# Altium schematic sheet Э3_6.SchDoc
size 420 x 297 mm; SheetNumber: 6; Scale: 1:1; DocumentType: Схема электрическая принципиальная
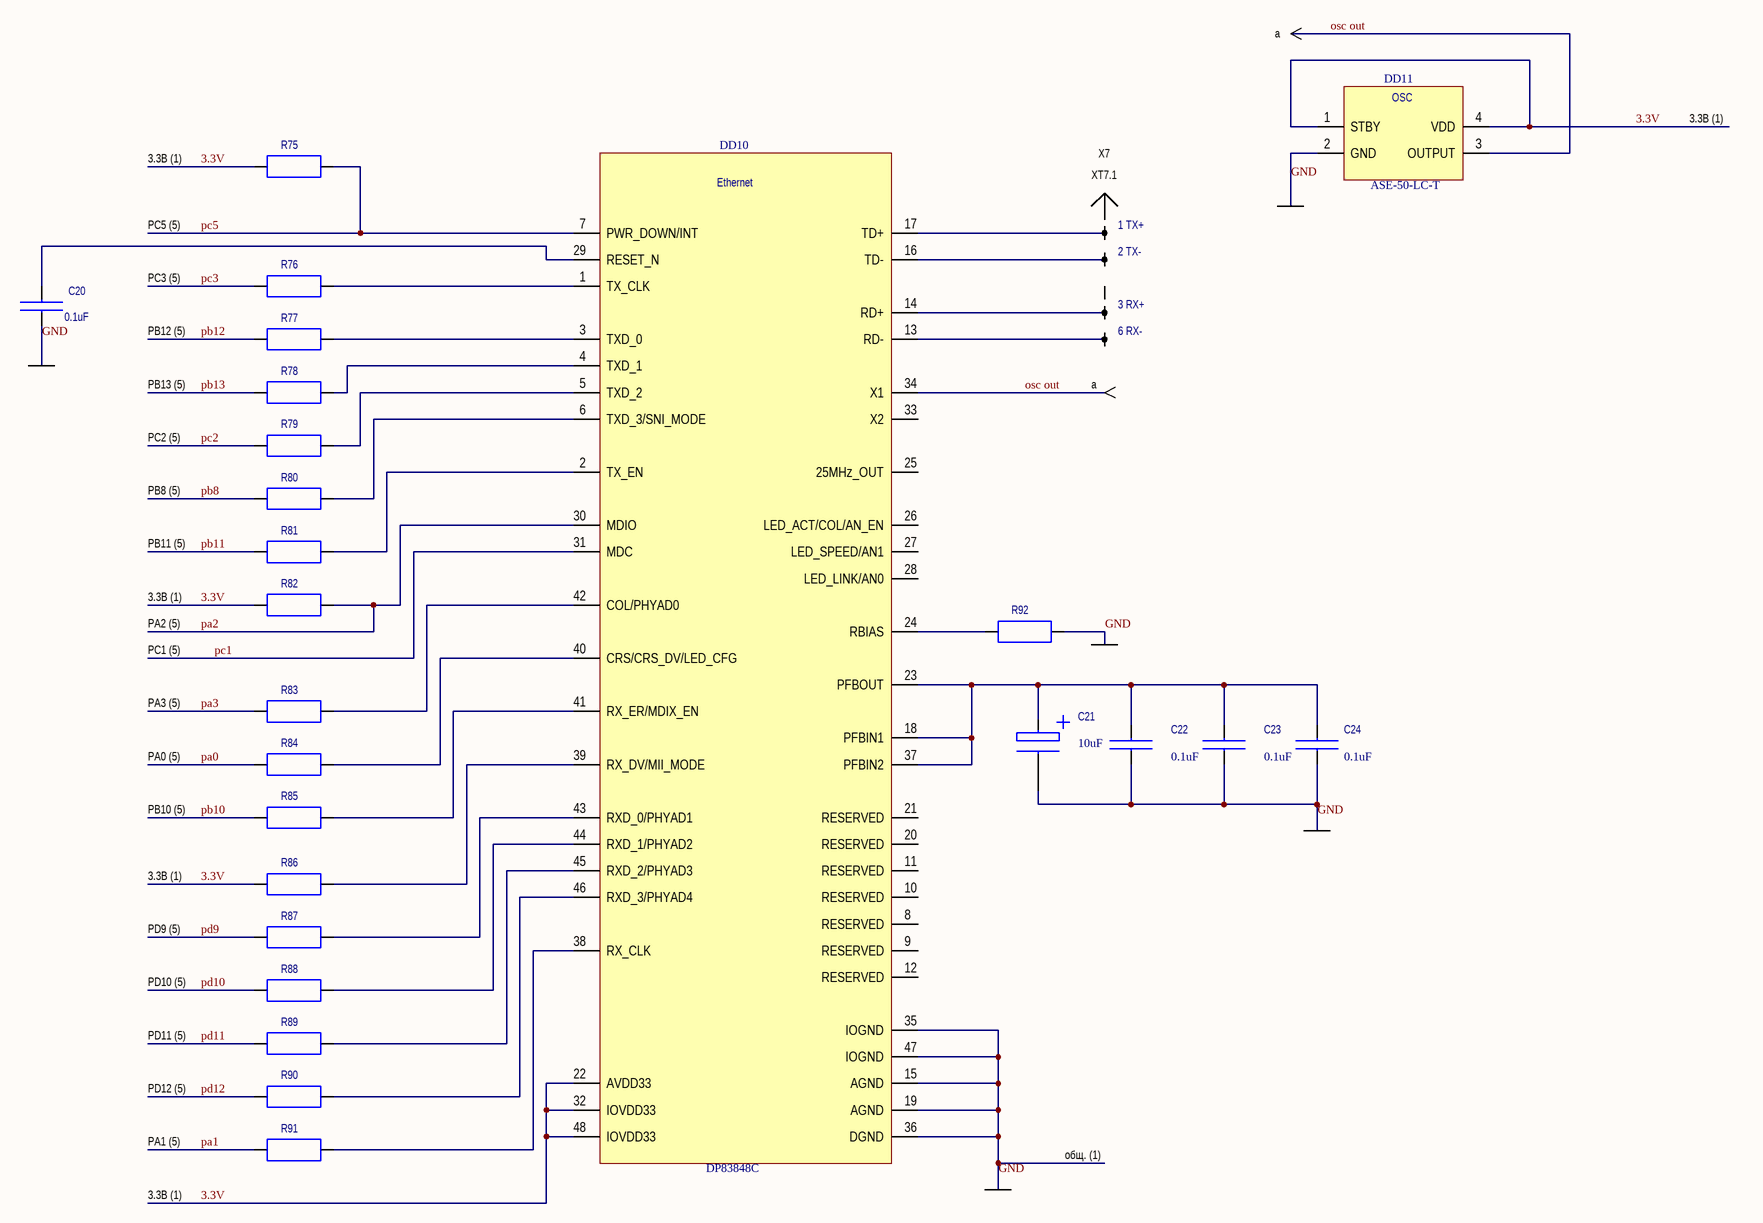
[diagram p0: Э3_6.SchDoc]

## Parts
C20  0.1uF  [CAP0805]
C21  10uF  [CAPT]
C22  0.1uF  [CAP0805]
C23  0.1uF
C24  0.1uF
DD10  DP83848C  [VBH48A_N]
DD11  ASE-50-LC-T  [ASE_OSC]
R75  2.2k  [RES0805]  (value not drawn)
R76  51  [RES0805]  (value not drawn)
R77  51  [RES0805]  (value not drawn)
R78  51  [RES0805]  (value not drawn)
R79  51  [RES0805]  (value not drawn)
R80  51  [RES0805]  (value not drawn)
R81  51  [RES0805]  (value not drawn)
R82  1.5k  [RES0805]  (value not drawn)
R83  51  [RES0805]  (value not drawn)
R84  51  [RES0805]  (value not drawn)
R85  51  [RES0805]  (value not drawn)
R86  2.2k  [RES0805]  (value not drawn)
R87  51  [RES0805]  (value not drawn)
R88  51  [RES0805]  (value not drawn)
R89  51  [RES0805]  (value not drawn)
R90  51  [RES0805]  (value not drawn)
R91  51  [RES0805]  (value not drawn)
R92  4.87k  (value not drawn)
X7  1 TX+  [RJ45]  (parts A,B,C,F of 7)

## Nets
3.3V: DD10.22(AVDD33) DD10.32(IOVDD33) DD10.48(IOVDD33) DD11.1(STBY) DD11.4(VDD) R75.1 R82.1 R86.1
GND: C20.1 C22.1 C23.1 C24.1 DD10.15(AGND) DD10.19(AGND) DD10.35(IOGND) DD10.36(DGND) DD10.47(IOGND) DD11.2(GND) R92.2
osc out: DD10.34(X1) DD11.3(OUTPUT)
pa0: R84.1
pa1: R91.1
pa2: DD10.30(MDIO) R82.2
pa3: R83.1
pb8: R80.1
pb10: R85.1
pb11: R81.1
pb12: R77.1
pb13: R78.1
pc1: DD10.31(MDC)
pc2: R79.1
pc3: R76.1
pc5: DD10.7(PWR_DOWN/INT) R75.2
pd9: R87.1
pd10: R88.1
pd11: R89.1
pd12: R90.1
NetC20_2: C20.2 DD10.29(RESET_N)
NetC21_1: C21.1 C22.2 C23.2 C24.2 DD10.18(PFBIN1) DD10.23(PFBOUT) DD10.37(PFBIN2)
NetDD10_1: DD10.1(TX_CLK) R76.2
NetDD10_2: DD10.2(TX_EN) R81.2
NetDD10_3: DD10.3(TXD_0) R77.2
NetDD10_4: DD10.4(TXD_1) R78.2
NetDD10_5: DD10.5(TXD_2) R79.2
NetDD10_6: DD10.6(TXD_3/SNI_MODE) R80.2
NetDD10_13: DD10.13(RD-) X7.6
NetDD10_14: DD10.14(RD+) X7.3
NetDD10_16: DD10.16(TD-) X7.2
NetDD10_17: DD10.17(TD+) X7.1
NetDD10_24: DD10.24(RBIAS) R92.1
NetDD10_38: DD10.38(RX_CLK) R91.2
NetDD10_39: DD10.39(RX_DV/MII_MODE) R86.2
NetDD10_40: DD10.40(CRS/CRS_DV/LED_CFG) R84.2
NetDD10_41: DD10.41(RX_ER/MDIX_EN) R85.2
NetDD10_42: DD10.42(COL/PHYAD0) R83.2
NetDD10_43: DD10.43(RXD_0/PHYAD1) R87.2
NetDD10_44: DD10.44(RXD_1/PHYAD2) R88.2
NetDD10_45: DD10.45(RXD_2/PHYAD3) R89.2
NetDD10_46: DD10.46(RXD_3/PHYAD4) R90.2

Not connected (* = marked no-connect by the designer): C21 2; DD10 8(RESERVED) 9(RESERVED) 10(RESERVED) 11(RESERVED) 12(RESERVED) 20(RESERVED) 21(RESERVED) 25(25MHz_OUT) 26(LED_ACT/COL/AN_EN) 27(LED_SPEED/AN1) 28(LED_LINK/AN0) 33(X2)

## Notes on the sheet
- a
- 3.3В (1)
- (near X7) XT7.1
- X7
- PC5 (5)
- PC3 (5)
- PB12 (5)
- PB13 (5)
- (near X7) a
- PC2 (5)
- PB8 (5)
- PB11 (5)
- PA2 (5)
- PC1 (5)
- PA3 (5)
- PA0 (5)
- PB10 (5)
- PD9 (5)
- PD10 (5)
- PD11 (5)
- PD12 (5)
- PA1 (5)
- общ. (1)
- Подп. и дата
- Инв. № дубл.
- Взам. инв. №
- Инв. № подл.
- Изм.
- Лист
- № докум.
- Подп.
- Дата
- 2.106-A3
- Копировал
- Формат А3
- (in symbol ASE-50-LC-T) OSC
- (in symbol DP83848C) Ethernet

## Library data of the parts
C20 C22 = C
C21 = CL
C23 C24 = C_2
R75-R91 = R
R92 = R_1
X7 = RJ45